# Altium schematic sheet VC_Interface.SchDoc: Interface
size A4; SheetNumber: 2; SheetTotal: 4; FileInfo: VC_Interface.SchDoc
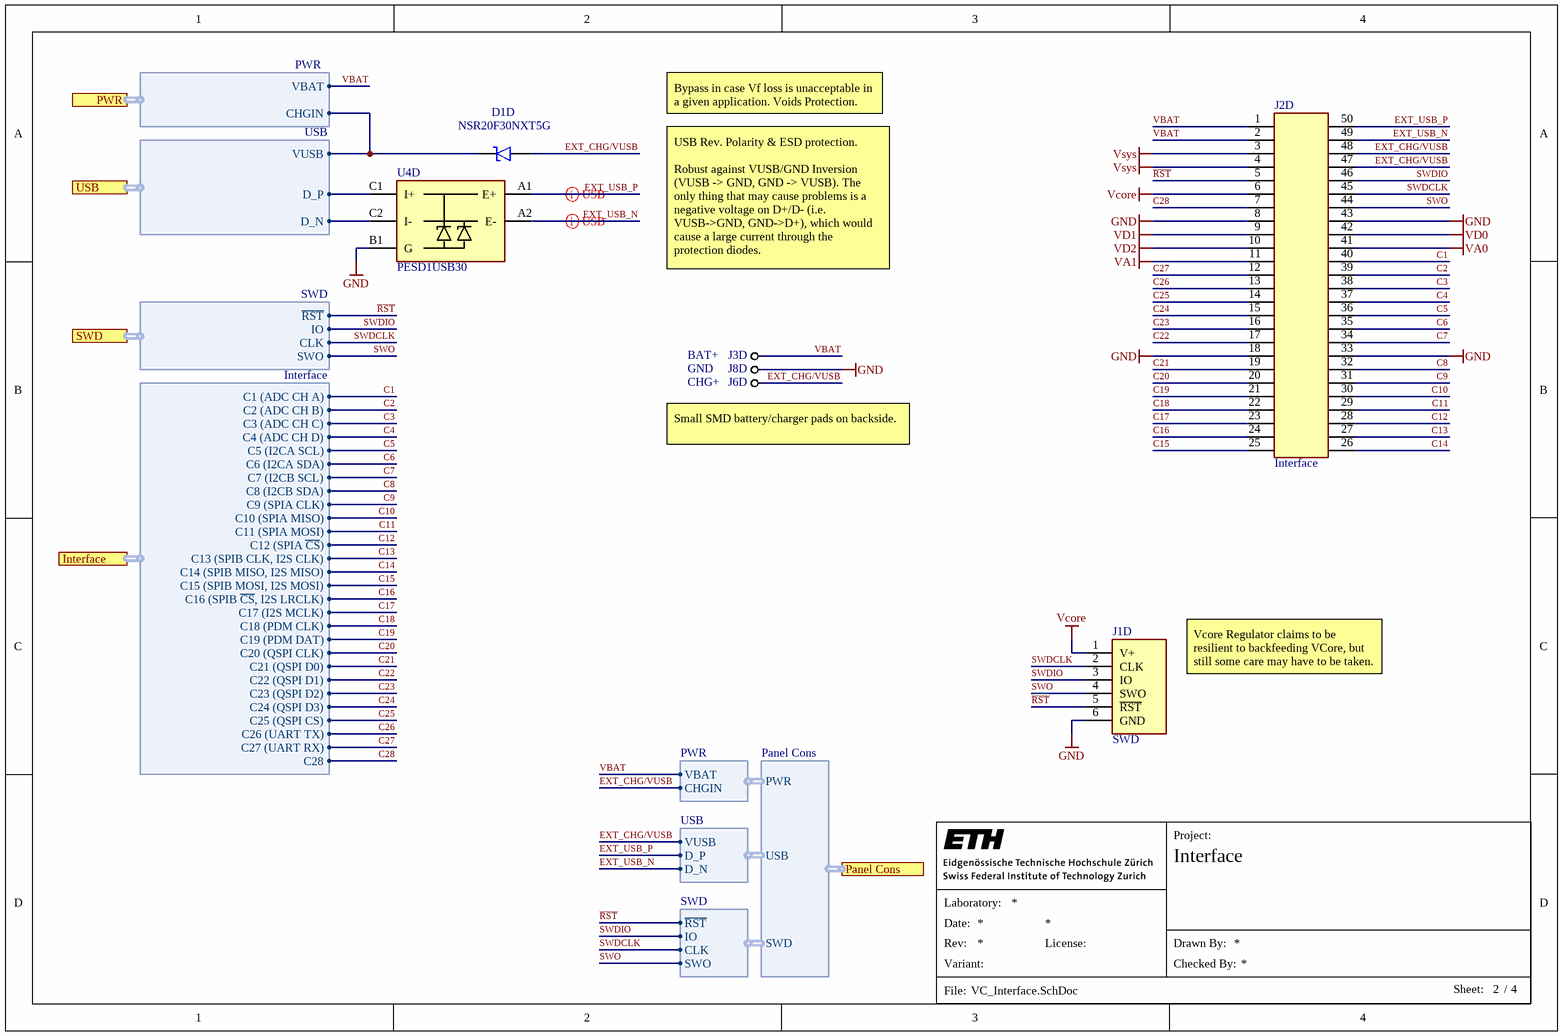
[diagram p0: VC_Interface.SchDoc]

## Parts
D1D  NSR20F30NXT5G  [DSN2_ONSemi]
J1D  SWD  [CONN_SWD_PADS_P1.27mm]  (no BOM)
J2D  Interface  [CONN_COMBI_50P]
J3D  BAT+  [PADSMD_ROUND]  (no BOM)
J6D  CHG+  [PADSMD_ROUND]  (no BOM)
J8D  GND  [PADSMD_ROUND]  (no BOM)
U4D  PESD1USB30  [WLCSP_5_2-1-2_P0.4]

## Ports
Interface (harness Interface), Panel Cons (harness Panel Cons), PWR (harness PWR), SWD (harness SWD), USB (harness USB)

## Harnesses
PWR: CHGIN, VBAT
SWD: ~{RST}, IO, CLK, SWO
Interface: C1 (ADC CH A), C2 (ADC CH B), C3 (ADC CH C), C4 (ADC CH D), C5 (I2CA SCL), C6 (I2CA SDA), C7 (I2CB SCL), C8 (I2CB SDA), C9 (SPIA CLK), C10 (SPIA MISO), C11 (SPIA MOSI), C12 (SPIA ~{CS}), C13 (SPIB CLK, I2S CLK), C14 (SPIB MISO, I2S MISO), C15 (SPIB MOSI, I2S MOSI), C16 (SPIB ~{CS}, I2S LRCLK), C17 (I2S MCLK), C18 (PDM CLK), C19 (PDM DAT), C20 (QSPI CLK), C21 (QSPI D0), C22 (QSPI D1), C23 (QSPI D2), C24 (QSPI D3), C25 (QSPI CS), C26 (UART TX), C27 (UART RX), C28
USB: VUSB, D_P, D_N
Panel Cons: PWR, USB, SWD

## Nets
GND: J1D.6(GND) J2D.8 J2D.18 J2D.33 J2D.43 J8D.0 U4D.B1(G)
VA0: J2D.41
VA1: J2D.11
Vcore: J1D.1(V+) J2D.6
VD0: J2D.42
VD1: J2D.9
VD2: J2D.10
Vsys: J2D.3 J2D.4
C1: J2D.40 ; port Interface.C1 (ADC CH A)
C2: J2D.39 ; port Interface.C2 (ADC CH B)
C3: J2D.38 ; port Interface.C3 (ADC CH C)
C4: J2D.37 ; port Interface.C4 (ADC CH D)
C5: J2D.36 ; port Interface.C5 (I2CA SCL)
C6: J2D.35 ; port Interface.C6 (I2CA SDA)
C7: J2D.34 ; port Interface.C7 (I2CB SCL)
C8: J2D.32 ; port Interface.C8 (I2CB SDA)
C9: J2D.31 ; port Interface.C9 (SPIA CLK)
C10: J2D.30 ; port Interface.C10 (SPIA MISO)
C11: J2D.29 ; port Interface.C11 (SPIA MOSI)
C12: J2D.28 ; port Interface.C12 (SPIA ~{CS})
C13: J2D.27 ; port Interface.C13 (SPIB CLK, I2S CLK)
C14: J2D.26 ; port Interface.C14 (SPIB MISO, I2S MISO)
C15: J2D.25 ; port Interface.C15 (SPIB MOSI, I2S MOSI)
C16: J2D.24 ; port Interface.C16 (SPIB ~{CS}, I2S LRCLK)
C17: J2D.23 ; port Interface.C17 (I2S MCLK)
C18: J2D.22 ; port Interface.C18 (PDM CLK)
C19: J2D.21 ; port Interface.C19 (PDM DAT)
C20: J2D.20 ; port Interface.C20 (QSPI CLK)
C21: J2D.19 ; port Interface.C21 (QSPI D0)
C22: J2D.17 ; port Interface.C22 (QSPI D1)
C23: J2D.16 ; port Interface.C23 (QSPI D2)
C24: J2D.15 ; port Interface.C24 (QSPI D3)
C25: J2D.14 ; port Interface.C25 (QSPI CS)
C26: J2D.13 ; port Interface.C26 (UART TX)
C27: J2D.12 ; port Interface.C27 (UART RX)
C28: J2D.7 ; port Interface.C28
EXT_CHG/VUSB: D1D.2(Anode) J2D.47 J2D.48 J6D.0 ; harness USB.VUSB, harness PWR.CHGIN
EXT_USB_N: J2D.49 U4D.A2(E-) ; harness USB.D_N
EXT_USB_P: J2D.50 U4D.A1(E+) ; harness USB.D_P
~{RST}: J1D.5(~{RST}) J2D.5 ; port SWD.~{RST}, harness SWD.~{RST}
SWDCLK: J1D.2(CLK) J2D.45 ; port SWD.CLK, harness SWD.CLK
SWDIO: J1D.3(IO) J2D.46 ; port SWD.IO, harness SWD.IO
SWO: J1D.4(SWO) J2D.44 ; port SWD.SWO, harness SWD.SWO
VBAT: J2D.1 J2D.2 J3D.0 ; port PWR.VBAT, harness PWR.VBAT
NetD1D_1: D1D.1(Cathode) ; port PWR.CHGIN, port USB.VUSB
NetU4D_C1: U4D.C1(I+) ; port USB.D_P
NetU4D_C2: U4D.C2(I-) ; port USB.D_N

## Layout directives
differential pair: EXT_USB_N, EXT_USB_P

## Notes on the sheet
- Bypass in case Vf loss is unacceptable in a given application. Voids Protection.
- USB Rev. Polarity & ESD protection.
  Robust against VUSB/GND Inversion (VUSB -> GND, GND -> VUSB). The only thing that may cause problems is a negative voltage on D+/D- (i.e. VUSB->GND, GND->D+), which would cause a large current through the protection diodes.
- Small SMD battery/charger pads on backside.
- Vcore Regulator claims to be resilient to backfeeding VCore, but still some care may have to be taken.
- Project:
- Laboratory:
- Date:
- File:
- Rev:
- Variant:
- License:
- Drawn By:
- Checked By:
- Sheet:
- /

## Library data of the parts
D1D = D_NSR20F30NXT5G: Small Signal Schottky Diode, 30 V, 2 A; Manufacturer: ON Semiconductor; Supplier 1: Mouser; Manufacturer Part Number: NSR20F30NXT5G; Supplier Part Number 1: 863-NSR20F30NXT5G
J1D = CONN_SWD_PADS: SWD Pogo Pads
J2D = CONN_50P_M_COMBI_INTERFACE: 50Pin 0.4mm pitch connector footprint that accepts (male) connectors intended for different stacking heights: / Hirose - DF40C-50DP-0.4V(51) for 1.5mm - 3mm stacking height / JAE - WP7B-P050VA1-R8000 - for 0.7mm stacking height
J3D J6D J8D = PADSMD: SMD Pad
U4D = PESD1USB30: ESD Suppressor Diode TVS Uni-Dir 5V 5-Pin WLCSP T/R; Manufacturer: NXP Semiconductors; Manufacturer Part Number: PESD1USB30; Supplier 1: Mouser; Supplier Part Number 1: 771-PESD1USB30Z